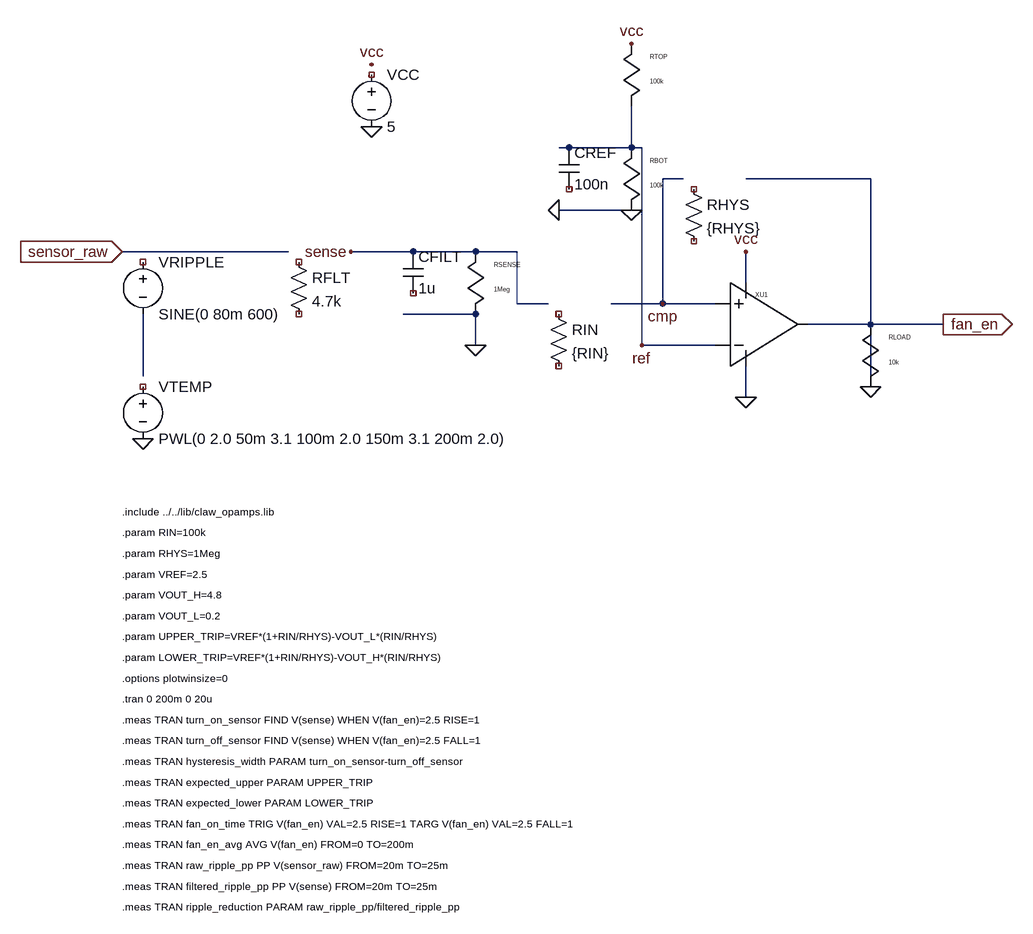
[diagram p0: schematic schmitt_trigger_temperature_switch.asc]
schmitt_trigger_temperature_switch.asc, the LTspice schematic file:
Version 4
SHEET 1 1570 1543
WIRE 96 448 96 544
WIRE 64 352 320 352
WIRE 416 352 672 352
WIRE 672 352 672 432
WIRE 672 432 720 432
WIRE 816 432 896 432
WIRE 896 432 976 432
WIRE 896 432 896 240
WIRE 896 240 928 240
WIRE 1024 240 1216 240
WIRE 1216 240 1216 464
WIRE 1120 464 1328 464
WIRE 1216 464 1216 560
WIRE 496 448 608 448
WIRE 608 448 608 496
WIRE 736 192 848 192
WIRE 848 128 848 192
WIRE 736 288 848 288
WIRE 848 192 864 192
WIRE 864 192 864 496
WIRE 864 496 976 496
WIRE 1024 400 1024 352
WIRE 1024 528 1024 576
SYMBOL voltage 96 352 R0
SYMATTR InstName VRIPPLE
SYMATTR Value SINE(0 80m 600)
SYMBOL voltage 96 544 R0
SYMATTR InstName VTEMP
SYMATTR Value PWL(0 2.0 50m 3.1 100m 2.0 150m 3.1 200m 2.0)
SYMBOL voltage 448 64 R0
SYMATTR InstName VCC
SYMATTR Value 5
SYMBOL res 320 352 R0
SYMATTR InstName RFLT
SYMATTR Value 4.7k
SYMBOL cap 496 352 R0
SYMATTR InstName CFILT
SYMATTR Value 1u
SYMBOL res_v 608 352 R0
SYMATTR InstName RSENSE
SYMATTR Value 1Meg
SYMBOL res 720 432 R0
SYMATTR InstName RIN
SYMATTR Value {RIN}
SYMBOL res 928 240 R0
SYMATTR InstName RHYS
SYMATTR Value {RHYS}
SYMBOL res_v 848 32 R0
SYMATTR InstName RTOP
SYMATTR Value 100k
SYMBOL res_v 848 192 R0
SYMATTR InstName RBOT
SYMATTR Value 100k
SYMBOL cap 736 192 R0
SYMATTR InstName CREF
SYMATTR Value 100n
SYMBOL opamp2 976 400 R0
SYMATTR InstName XU1
SYMATTR Value CLAW_IDEAL_OPAMP
SYMBOL res_v 1216 464 R0
SYMATTR InstName RLOAD
SYMATTR Value 10k
FLAG 64 352 sensor_raw
IOPIN 64 352 In
FLAG 1328 464 fan_en
IOPIN 1328 464 Out
FLAG 96 640 0
FLAG 448 64 vcc
FLAG 448 160 0
FLAG 608 496 0
FLAG 848 32 vcc
FLAG 848 288 0
FLAG 736 288 0
FLAG 1216 560 0
FLAG 416 352 sense
FLAG 864 496 ref
FLAG 896 432 cmp
FLAG 1024 352 vcc
FLAG 1024 576 0
TEXT 64 752 Left 1 !.include ../../lib/claw_opamps.lib
TEXT 64 784 Left 1 !.param RIN=100k
TEXT 64 816 Left 1 !.param RHYS=1Meg
TEXT 64 848 Left 1 !.param VREF=2.5
TEXT 64 880 Left 1 !.param VOUT_H=4.8
TEXT 64 912 Left 1 !.param VOUT_L=0.2
TEXT 64 944 Left 1 !.param UPPER_TRIP=VREF*(1+RIN/RHYS)-VOUT_L*(RIN/RHYS)
TEXT 64 976 Left 1 !.param LOWER_TRIP=VREF*(1+RIN/RHYS)-VOUT_H*(RIN/RHYS)
TEXT 64 1008 Left 1 !.options plotwinsize=0
TEXT 64 1040 Left 1 !.tran 0 200m 0 20u
TEXT 64 1072 Left 1 !.meas TRAN turn_on_sensor FIND V(sense) WHEN V(fan_en)=2.5 RISE=1
TEXT 64 1104 Left 1 !.meas TRAN turn_off_sensor FIND V(sense) WHEN V(fan_en)=2.5 FALL=1
TEXT 64 1136 Left 1 !.meas TRAN hysteresis_width PARAM turn_on_sensor-turn_off_sensor
TEXT 64 1168 Left 1 !.meas TRAN expected_upper PARAM UPPER_TRIP
TEXT 64 1200 Left 1 !.meas TRAN expected_lower PARAM LOWER_TRIP
TEXT 64 1232 Left 1 !.meas TRAN fan_on_time TRIG V(fan_en) VAL=2.5 RISE=1 TARG V(fan_en) VAL=2.5 FALL=1
TEXT 64 1264 Left 1 !.meas TRAN fan_en_avg AVG V(fan_en) FROM=0 TO=200m
TEXT 64 1296 Left 1 !.meas TRAN raw_ripple_pp PP V(sensor_raw) FROM=20m TO=25m
TEXT 64 1328 Left 1 !.meas TRAN filtered_ripple_pp PP V(sense) FROM=20m TO=25m
TEXT 64 1360 Left 1 !.meas TRAN ripple_reduction PARAM raw_ripple_pp/filtered_ripple_pp

The netlist it stands for:
* schmitt_trigger_temperature_switch.asc
VRIPPLE NC_01 N001 SINE(0 80m 600)
VTEMP NC_02 0 PWL(0 2.0 50m 3.1 100m 2.0 150m 3.1 200m 2.0)
VCC NC_03 0 5
RFLT NC_04 NC_05 4.7k
CFILT sense NC_06 1u
RSENSE sense 0 1Meg
RIN NC_07 NC_08 {RIN}
RHYS NC_09 NC_10 {RHYS}
RTOP vcc ref 100k
RBOT ref 0 100k
CREF ref NC_11 100n
XXU1 CLAW_IDEAL_OPAMP CLAW_IDEAL_OPAMP
RLOAD 0 0 10k
.include ../../lib/claw_opamps.lib
.param RIN=100k
.param RHYS=1Meg
.param VREF=2.5
.param VOUT_H=4.8
.param VOUT_L=0.2
.param UPPER_TRIP=VREF*(1+RIN/RHYS)-VOUT_L*(RIN/RHYS)
.param LOWER_TRIP=VREF*(1+RIN/RHYS)-VOUT_H*(RIN/RHYS)
.options plotwinsize=0
.tran 0 200m 0 20u
.meas TRAN turn_on_sensor FIND V(sense) WHEN V(fan_en)=2.5 RISE=1
.meas TRAN turn_off_sensor FIND V(sense) WHEN V(fan_en)=2.5 FALL=1
.meas TRAN hysteresis_width PARAM turn_on_sensor-turn_off_sensor
.meas TRAN expected_upper PARAM UPPER_TRIP
.meas TRAN expected_lower PARAM LOWER_TRIP
.meas TRAN fan_on_time TRIG V(fan_en) VAL=2.5 RISE=1 TARG V(fan_en) VAL=2.5 FALL=1
.meas TRAN fan_en_avg AVG V(fan_en) FROM=0 TO=200m
.meas TRAN raw_ripple_pp PP V(sensor_raw) FROM=20m TO=25m
.meas TRAN filtered_ripple_pp PP V(sense) FROM=20m TO=25m
.meas TRAN ripple_reduction PARAM raw_ripple_pp/filtered_ripple_pp
.backanno
.end